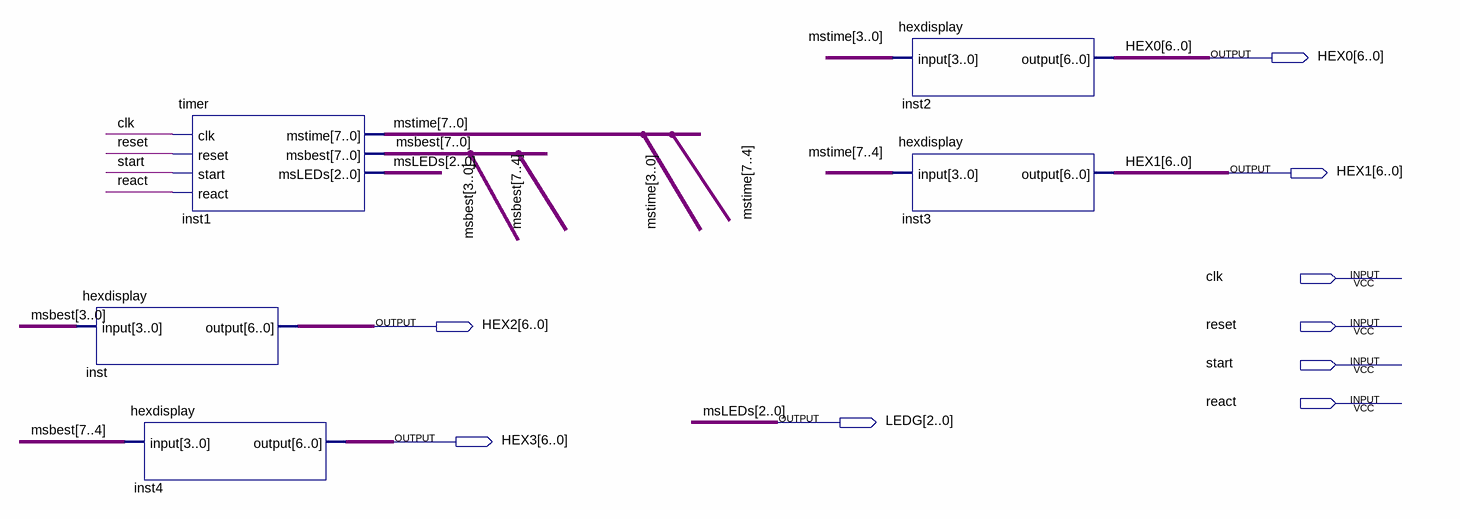
[diagram p0: schematic sheet]
// Quartus schematic reaction.bdf as structural Verilog: 5 symbols, 9 pins
module reaction (
  input  clk,
  input  reset,
  input  start,
  input  react,
  output [6:0] HEX0,
  output [6:0] HEX1,
  output [6:0] HEX2,
  output [2:0] LEDG,
  output [6:0] HEX3
);

  wire [7:0] msbest, mstime;

  hexdisplay inst (.\input (msbest[3:0]), .\output (HEX2));
  timer inst1 (.clk(clk), .reset(reset), .start(start), .react(react), .mstime(mstime), .msbest(msbest), .msLEDs(LEDG));
  hexdisplay inst4 (.\input (msbest[7:4]), .\output (HEX3));
  hexdisplay inst2 (.\input (mstime[3:0]), .\output (HEX0));
  hexdisplay inst3 (.\input (mstime[7:4]), .\output (HEX1));

  // Other names for the same wires on the sheet: msLEDs[2:0] = LEDG
endmodule
